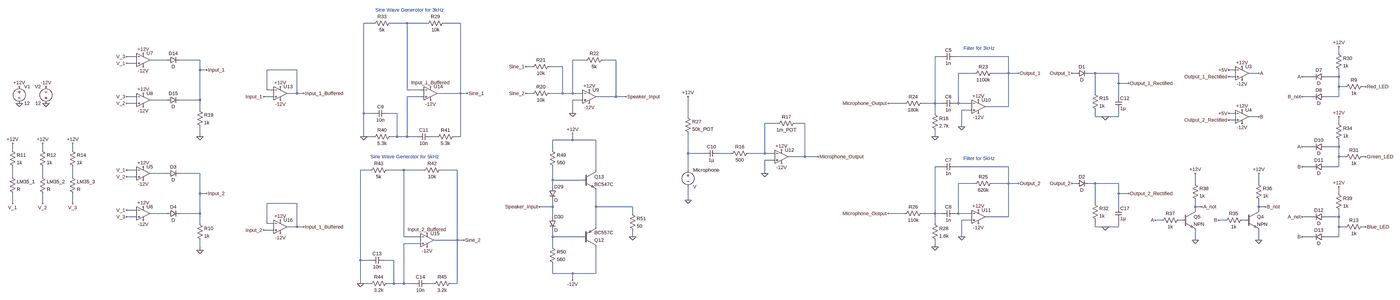
[diagram p0: schematic Project Schematic.asc, whole sheet]
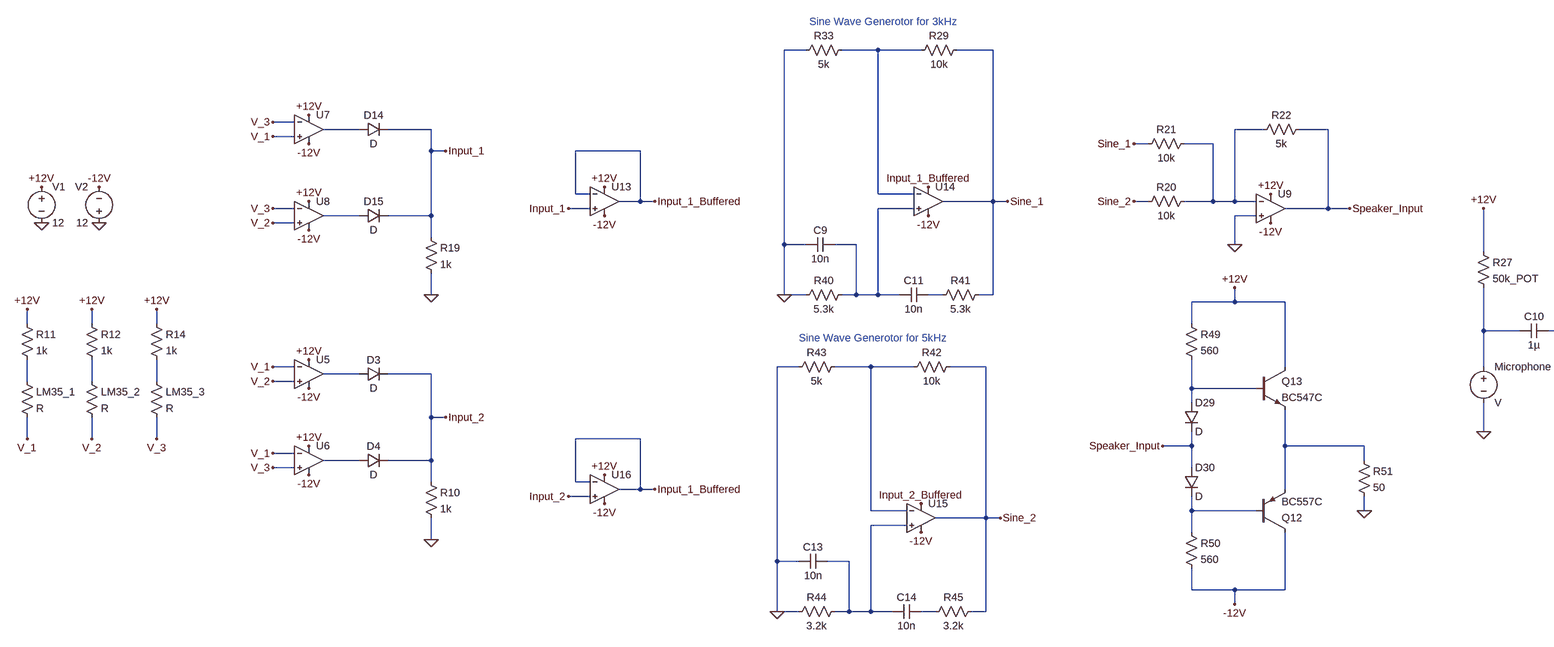
[diagram p1: schematic Project Schematic.asc, part, row 1 of 1, column 1 of 2]
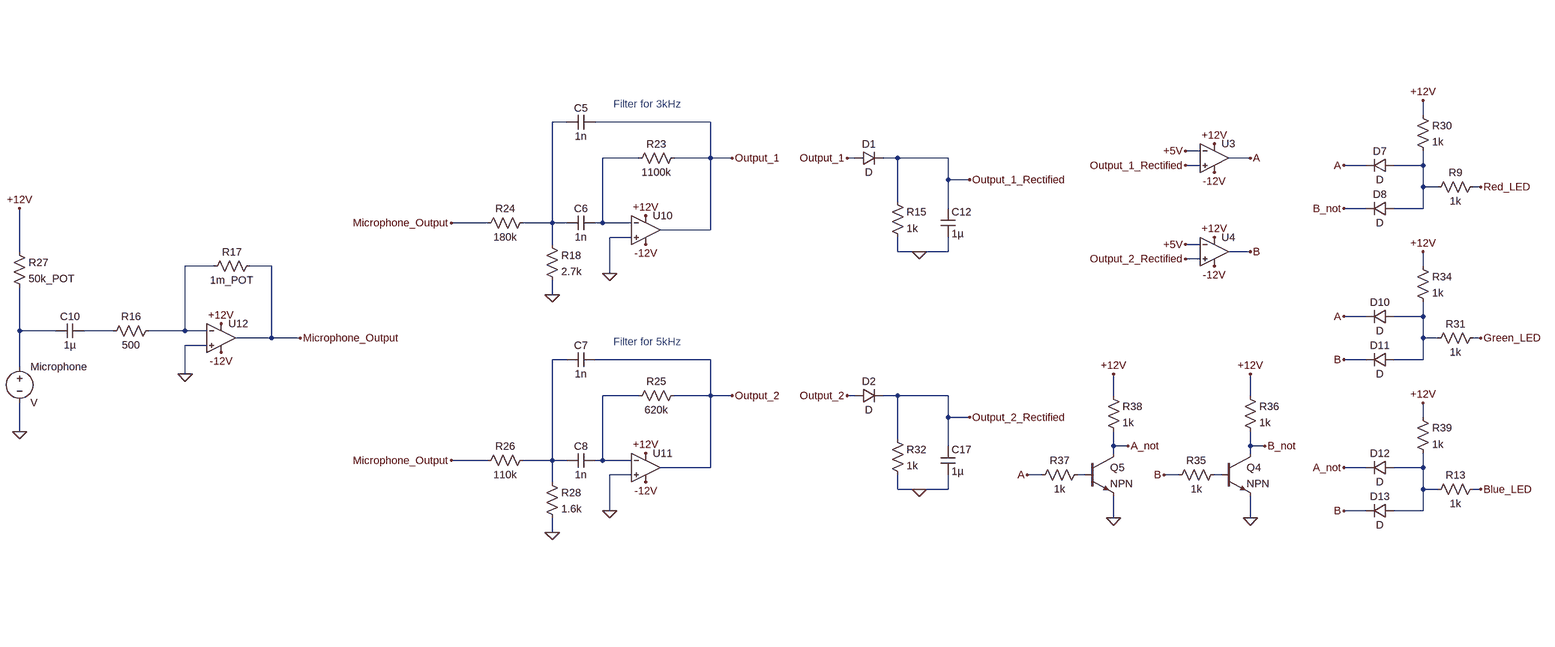
[diagram p2: schematic Project Schematic.asc, part, row 1 of 1, column 2 of 2]
Project Schematic.asc, the LTspice schematic file:
Version 4
SHEET 1 7060 2464
WIRE 1424 -832 1376 -832
WIRE 1584 -832 1504 -832
WIRE 1680 -832 1584 -832
WIRE 1840 -832 1760 -832
WIRE 6784 -688 6784 -720
WIRE 272 -672 224 -672
WIRE 4880 -672 4848 -672
WIRE 5200 -672 4944 -672
WIRE 416 -656 336 -656
WIRE 576 -656 480 -656
WIRE 2448 -656 2384 -656
WIRE 2592 -656 2528 -656
WIRE 272 -640 224 -640
WIRE 2192 -624 2160 -624
WIRE 2336 -624 2272 -624
WIRE 576 -608 576 -656
WIRE 608 -608 576 -608
WIRE 1056 -608 912 -608
WIRE 6288 -608 6256 -608
WIRE 5040 -592 4960 -592
WIRE 5200 -592 5200 -672
WIRE 5200 -592 5120 -592
WIRE 5248 -592 5200 -592
WIRE 5520 -592 5504 -592
WIRE 5616 -592 5584 -592
WIRE 5728 -592 5616 -592
WIRE 6400 -592 6352 -592
WIRE 6288 -576 6256 -576
WIRE 6656 -576 6608 -576
WIRE 6784 -576 6784 -608
WIRE 6784 -576 6720 -576
WIRE 5728 -544 5728 -592
WIRE 5776 -544 5728 -544
WIRE 6784 -528 6784 -576
WIRE 6816 -528 6784 -528
WIRE 6912 -528 6896 -528
WIRE 912 -512 912 -608
WIRE 944 -512 912 -512
WIRE 1584 -512 1584 -832
WIRE 1664 -512 1584 -512
WIRE 1056 -496 1056 -608
WIRE 1056 -496 1008 -496
WIRE 1088 -496 1056 -496
WIRE 1840 -496 1840 -832
WIRE 1840 -496 1728 -496
WIRE 1872 -496 1840 -496
WIRE 2192 -496 2160 -496
WIRE 2336 -496 2336 -624
WIRE 2336 -496 2272 -496
WIRE 2384 -496 2384 -656
WIRE 2384 -496 2336 -496
WIRE 2432 -496 2384 -496
WIRE 5616 -496 5616 -592
WIRE 272 -480 224 -480
WIRE 944 -480 896 -480
WIRE 1664 -480 1584 -480
WIRE 2592 -480 2592 -656
WIRE 2592 -480 2496 -480
WIRE 2640 -480 2592 -480
WIRE 5728 -480 5728 -544
WIRE 6656 -480 6608 -480
WIRE 6784 -480 6784 -528
WIRE 6784 -480 6720 -480
WIRE 416 -464 336 -464
WIRE 576 -464 576 -608
WIRE 576 -464 480 -464
WIRE 2432 -464 2384 -464
WIRE 272 -448 224 -448
WIRE 4704 -448 4624 -448
WIRE 4848 -448 4848 -672
WIRE 4848 -448 4784 -448
WIRE 4880 -448 4848 -448
WIRE 4960 -448 4960 -592
WIRE 4960 -448 4944 -448
WIRE 5024 -448 4960 -448
WIRE 5200 -432 5200 -592
WIRE 5200 -432 5088 -432
WIRE 576 -416 576 -464
WIRE 5024 -416 4976 -416
WIRE 1376 -400 1376 -832
WIRE 1424 -400 1376 -400
WIRE 1536 -400 1488 -400
WIRE 2384 -400 2384 -464
WIRE 4848 -400 4848 -448
WIRE 6288 -400 6256 -400
WIRE 3664 -384 3664 -480
WIRE 5616 -384 5616 -416
WIRE 5664 -384 5616 -384
WIRE 5728 -384 5728 -416
WIRE 5728 -384 5664 -384
WIRE 6400 -384 6352 -384
WIRE 6288 -368 6256 -368
WIRE 4096 -352 4032 -352
WIRE 4224 -352 4176 -352
WIRE 6784 -352 6784 -384
WIRE 4976 -336 4976 -416
WIRE 576 -288 576 -336
WIRE 1376 -288 1376 -400
WIRE 1424 -288 1376 -288
WIRE 1536 -288 1536 -400
WIRE 1536 -288 1504 -288
WIRE 1584 -288 1584 -480
WIRE 1584 -288 1536 -288
WIRE 1632 -288 1584 -288
WIRE 1728 -288 1696 -288
WIRE 1840 -288 1840 -496
WIRE 1840 -288 1808 -288
WIRE 4848 -288 4848 -320
WIRE 2384 -272 2384 -304
WIRE 2384 -272 2288 -272
WIRE 2496 -272 2384 -272
WIRE 6656 -240 6608 -240
WIRE 6784 -240 6784 -272
WIRE 6784 -240 6720 -240
WIRE -464 -224 -464 -256
WIRE -320 -224 -320 -256
WIRE -176 -224 -176 -256
WIRE 2288 -224 2288 -272
WIRE 3664 -208 3664 -304
WIRE 3744 -208 3664 -208
WIRE 3872 -208 3808 -208
WIRE 4032 -208 4032 -352
WIRE 4032 -208 3952 -208
WIRE 4080 -208 4032 -208
WIRE 4224 -192 4224 -352
WIRE 4224 -192 4144 -192
WIRE 4288 -192 4224 -192
WIRE 6784 -192 6784 -240
WIRE 6816 -192 6784 -192
WIRE 6912 -192 6896 -192
WIRE 4080 -176 4032 -176
WIRE 4880 -144 4848 -144
WIRE 5200 -144 4944 -144
WIRE 6656 -144 6608 -144
WIRE 6784 -144 6784 -192
WIRE 6784 -144 6720 -144
WIRE 272 -128 224 -128
WIRE 1408 -128 1360 -128
WIRE 1568 -128 1488 -128
WIRE 1664 -128 1568 -128
WIRE 1824 -128 1744 -128
WIRE 2496 -128 2496 -272
WIRE 3664 -128 3664 -208
WIRE 416 -112 336 -112
WIRE 576 -112 480 -112
WIRE 4032 -112 4032 -176
WIRE -464 -96 -464 -144
WIRE -320 -96 -320 -144
WIRE -176 -96 -176 -144
WIRE 272 -96 224 -96
WIRE 2288 -80 2288 -144
WIRE 2432 -80 2288 -80
WIRE 5040 -64 4960 -64
WIRE 5200 -64 5200 -144
WIRE 5200 -64 5120 -64
WIRE 5248 -64 5200 -64
WIRE 5520 -64 5504 -64
WIRE 5616 -64 5584 -64
WIRE 5728 -64 5616 -64
WIRE 6096 -64 6096 -112
WIRE 6400 -64 6400 -112
WIRE 2288 -48 2288 -80
WIRE 576 -16 576 -112
WIRE 608 -16 576 -16
WIRE 5728 -16 5728 -64
WIRE 5776 -16 5728 -16
WIRE 6784 -16 6784 -48
WIRE 3664 16 3664 -48
WIRE -464 32 -464 -16
WIRE -320 32 -320 -16
WIRE -176 32 -176 -16
WIRE 1056 32 912 32
WIRE 5616 32 5616 -64
WIRE 2288 48 2288 16
WIRE 2288 48 2224 48
WIRE 2496 48 2496 -32
WIRE 2672 48 2496 48
WIRE 5728 48 5728 -16
WIRE 6096 48 6096 16
WIRE 6128 48 6096 48
WIRE 6400 48 6400 16
WIRE 6432 48 6400 48
WIRE 272 64 224 64
WIRE 6096 64 6096 48
WIRE 6400 64 6400 48
WIRE 416 80 336 80
WIRE 576 80 576 -16
WIRE 576 80 480 80
WIRE 2672 80 2672 48
WIRE 4704 80 4624 80
WIRE 4848 80 4848 -144
WIRE 4848 80 4784 80
WIRE 4880 80 4848 80
WIRE 4960 80 4960 -64
WIRE 4960 80 4944 80
WIRE 5024 80 4960 80
WIRE 272 96 224 96
WIRE 2288 96 2288 48
WIRE 5200 96 5200 -64
WIRE 5200 96 5088 96
WIRE 6656 96 6608 96
WIRE 6784 96 6784 64
WIRE 6784 96 6720 96
WIRE 5024 112 4976 112
WIRE 5936 112 5904 112
WIRE 6032 112 6016 112
WIRE 6240 112 6208 112
WIRE 6336 112 6320 112
WIRE 576 128 576 80
WIRE 912 128 912 32
WIRE 944 128 912 128
WIRE 4848 128 4848 80
WIRE 1056 144 1056 32
WIRE 1056 144 1008 144
WIRE 1088 144 1056 144
WIRE 2496 144 2496 48
WIRE 5616 144 5616 112
WIRE 5664 144 5616 144
WIRE 5728 144 5728 112
WIRE 5728 144 5664 144
WIRE 6784 144 6784 96
WIRE 6816 144 6784 144
WIRE 6912 144 6896 144
WIRE 944 160 896 160
WIRE 1568 192 1568 -128
WIRE 1648 192 1568 192
WIRE 2288 192 2288 160
WIRE 2432 192 2288 192
WIRE 2672 192 2672 160
WIRE 4976 192 4976 112
WIRE 6656 192 6608 192
WIRE 6784 192 6784 144
WIRE 6784 192 6720 192
WIRE 1824 208 1824 -128
WIRE 1824 208 1712 208
WIRE 1856 208 1824 208
WIRE 6096 208 6096 160
WIRE 6400 208 6400 160
WIRE 1648 224 1568 224
WIRE 2288 240 2288 192
WIRE 4848 240 4848 208
WIRE 576 256 576 208
WIRE 1360 304 1360 -128
WIRE 1408 304 1360 304
WIRE 1520 304 1472 304
WIRE 2288 368 2288 320
WIRE 2384 368 2288 368
WIRE 2496 368 2496 240
WIRE 2496 368 2384 368
WIRE 2384 400 2384 368
WIRE 1360 416 1360 304
WIRE 1408 416 1360 416
WIRE 1520 416 1520 304
WIRE 1520 416 1488 416
WIRE 1568 416 1568 224
WIRE 1568 416 1520 416
WIRE 1616 416 1568 416
WIRE 1712 416 1680 416
WIRE 1824 416 1824 208
WIRE 1824 416 1792 416
FLAG -432 -448 0
FLAG -304 -448 0
FLAG -464 -256 +12V
FLAG -320 -256 +12V
FLAG -176 -256 +12V
FLAG -432 -528 +12V
FLAG -464 32 V_1
FLAG -320 32 V_2
FLAG -176 32 V_3
FLAG 224 -448 V_2
FLAG 224 -672 V_3
FLAG 224 -480 V_3
FLAG 224 -640 V_1
FLAG 304 -688 +12V
FLAG 304 -496 +12V
FLAG 304 -624 -12V
FLAG 304 -432 -12V
FLAG 576 -288 0
FLAG 608 -608 Input_1
FLAG -304 -528 -12V
FLAG 2464 -448 -12V
FLAG 2464 -512 +12V
FLAG 2384 -400 0
FLAG 2160 -624 Sine_1
FLAG 2160 -496 Sine_2
FLAG 2640 -480 Speaker_Input
FLAG 4976 -336 0
FLAG 5056 -464 +12V
FLAG 5056 -400 -12V
FLAG 4976 192 0
FLAG 5056 64 +12V
FLAG 5056 128 -12V
FLAG 4624 -448 Microphone_Output
FLAG 4624 80 Microphone_Output
FLAG 3664 -480 +12V
FLAG 4288 -192 Microphone_Output
FLAG 224 96 V_3
FLAG 224 -96 V_2
FLAG 224 -128 V_1
FLAG 224 64 V_1
FLAG 304 -144 +12V
FLAG 304 48 +12V
FLAG 304 -80 -12V
FLAG 304 112 -12V
FLAG 576 256 0
FLAG 608 -16 Input_2
FLAG 5248 -592 Output_1
FLAG 5248 -64 Output_2
FLAG 6912 -528 Red_LED
FLAG 3664 16 0
FLAG 6256 -576 Output_1_Rectified
FLAG 6256 -368 Output_2_Rectified
FLAG 5504 -64 Output_2
FLAG 5776 -16 Output_2_Rectified
FLAG 6320 -624 +12V
FLAG 6320 -352 -12V
FLAG 6320 -560 -12V
FLAG 6320 -416 +12V
FLAG 6256 -608 +5V
FLAG 6256 -400 +5V
FLAG 6400 -592 A
FLAG 6400 -384 B
FLAG 6784 -720 +12V
FLAG 6912 -192 Green_LED
FLAG 6784 -384 +12V
FLAG 6400 208 0
FLAG 6400 -112 +12V
FLAG 6096 208 0
FLAG 6096 -112 +12V
FLAG 5904 112 A
FLAG 6128 48 A_not
FLAG 6432 48 B_not
FLAG 6208 112 B
FLAG 6912 144 Blue_LED
FLAG 6784 -48 +12V
FLAG 6608 -576 A
FLAG 6608 -144 B
FLAG 6608 192 B
FLAG 6608 -240 A
FLAG 6608 96 A_not
FLAG 6608 -480 B_not
FLAG 2672 192 0
FLAG 2384 -304 +12V
FLAG 2384 400 -12V
FLAG 2224 48 Speaker_Input
FLAG 5664 144 0
FLAG 5504 -592 Output_1
FLAG 5776 -544 Output_1_Rectified
FLAG 5664 -384 0
FLAG 4032 -112 0
FLAG 4112 -224 +12V
FLAG 4112 -160 -12V
FLAG 4848 -288 0
FLAG 4848 240 0
FLAG 976 -528 +12V
FLAG 976 -464 -12V
FLAG 1696 -528 Input_1_Buffered
FLAG 1696 -464 -12V
FLAG 1680 176 Input_2_Buffered
FLAG 1680 240 -12V
FLAG 1872 -496 Sine_1
FLAG 1856 208 Sine_2
FLAG 1360 416 0
FLAG 1376 -288 0
FLAG 896 -480 Input_1
FLAG 1088 -496 Input_1_Buffered
FLAG 976 112 +12V
FLAG 976 176 -12V
FLAG 896 160 Input_2
FLAG 1088 144 Input_1_Buffered
SYMBOL voltage -432 -544 R0
WINDOW 123 0 0 Left 2
WINDOW 39 0 0 Left 2
SYMATTR InstName V1
SYMATTR Value 12
SYMBOL voltage -304 -432 R180
WINDOW 0 24 96 Left 2
WINDOW 3 24 16 Left 2
WINDOW 123 0 0 Left 2
WINDOW 39 0 0 Left 2
SYMATTR InstName V2
SYMATTR Value 12
SYMBOL res -480 -112 R0
SYMATTR InstName LM35_1
SYMBOL res -336 -112 R0
SYMATTR InstName LM35_2
SYMBOL res -480 -240 R0
SYMATTR InstName R11
SYMATTR Value 1k
SYMBOL res -336 -240 R0
SYMATTR InstName R12
SYMATTR Value 1k
SYMBOL res -192 -112 R0
SYMATTR InstName LM35_3
SYMBOL res -192 -240 R0
SYMATTR InstName R14
SYMATTR Value 1k
SYMBOL Opamps\\UniversalOpamp2 304 -656 R0
SYMATTR InstName U7
SYMBOL Opamps\\UniversalOpamp2 304 -464 R0
SYMATTR InstName U8
SYMBOL res 560 -432 R0
SYMATTR InstName R19
SYMATTR Value 1k
SYMBOL diode 416 -640 R270
WINDOW 0 32 32 VTop 2
WINDOW 3 0 32 VBottom 2
SYMATTR InstName D14
SYMBOL diode 416 -448 R270
WINDOW 0 32 32 VTop 2
WINDOW 3 0 32 VBottom 2
SYMATTR InstName D15
SYMBOL Opamps\\UniversalOpamp2 2464 -480 R0
SYMATTR InstName U9
SYMBOL res 2288 -512 R90
WINDOW 0 0 56 VBottom 2
WINDOW 3 32 56 VTop 2
SYMATTR InstName R20
SYMATTR Value 10k
SYMBOL res 2288 -640 R90
WINDOW 0 0 56 VBottom 2
WINDOW 3 32 56 VTop 2
SYMATTR InstName R21
SYMATTR Value 10k
SYMBOL res 2544 -672 R90
WINDOW 0 0 56 VBottom 2
WINDOW 3 32 56 VTop 2
SYMATTR InstName R22
SYMATTR Value 5k
SYMBOL Opamps\\UniversalOpamp2 5056 -432 R0
SYMATTR InstName U10
SYMBOL res 5136 -608 R90
WINDOW 0 0 56 VBottom 2
WINDOW 3 32 56 VTop 2
SYMATTR InstName R23
SYMATTR Value 1100k
SYMBOL cap 4944 -688 R90
WINDOW 0 0 32 VBottom 2
WINDOW 3 32 32 VTop 2
SYMATTR InstName C5
SYMATTR Value 1n
SYMBOL cap 4944 -464 R90
WINDOW 0 0 32 VBottom 2
WINDOW 3 32 32 VTop 2
SYMATTR InstName C6
SYMATTR Value 1n
SYMBOL res 4800 -464 R90
WINDOW 0 0 56 VBottom 2
WINDOW 3 32 56 VTop 2
SYMATTR InstName R24
SYMATTR Value 180k
SYMBOL Opamps\\UniversalOpamp2 5056 96 R0
SYMATTR InstName U11
SYMBOL res 5136 -80 R90
WINDOW 0 0 56 VBottom 2
WINDOW 3 32 56 VTop 2
SYMATTR InstName R25
SYMATTR Value 620k
SYMBOL cap 4944 -160 R90
WINDOW 0 0 32 VBottom 2
WINDOW 3 32 32 VTop 2
SYMATTR InstName C7
SYMATTR Value 1n
SYMBOL cap 4944 64 R90
WINDOW 0 0 32 VBottom 2
WINDOW 3 32 32 VTop 2
SYMATTR InstName C8
SYMATTR Value 1n
SYMBOL res 4800 64 R90
WINDOW 0 0 56 VBottom 2
WINDOW 3 32 56 VTop 2
SYMATTR InstName R26
SYMATTR Value 110k
SYMBOL res 3648 -400 R0
SYMATTR InstName R27
SYMATTR Value 50k_POT
SYMBOL cap 3808 -224 R90
WINDOW 0 0 32 VBottom 2
WINDOW 3 32 32 VTop 2
SYMATTR InstName C10
SYMATTR Value 1µ
SYMBOL voltage 3664 -144 R0
SYMATTR InstName Microphone
SYMBOL Opamps\\UniversalOpamp2 304 -112 R0
SYMATTR InstName U5
SYMBOL Opamps\\UniversalOpamp2 304 80 R0
SYMATTR InstName U6
SYMBOL res 560 112 R0
SYMATTR InstName R10
SYMATTR Value 1k
SYMBOL diode 416 -96 R270
WINDOW 0 32 32 VTop 2
WINDOW 3 0 32 VBottom 2
SYMATTR InstName D3
SYMBOL diode 416 96 R270
WINDOW 0 32 32 VTop 2
WINDOW 3 0 32 VBottom 2
SYMATTR InstName D4
SYMBOL res 6912 -544 R90
WINDOW 0 0 56 VBottom 2
WINDOW 3 32 56 VTop 2
SYMATTR InstName R9
SYMATTR Value 1k
SYMBOL res 5600 16 R0
SYMATTR InstName R32
SYMATTR Value 1k
SYMBOL cap 5712 48 R0
SYMATTR InstName C17
SYMATTR Value 1µ
SYMBOL Opamps\\UniversalOpamp2 6320 -592 R0
SYMATTR InstName U3
SYMBOL Opamps\\UniversalOpamp2 6320 -384 R0
SYMATTR InstName U4
SYMBOL diode 6720 -592 R90
WINDOW 0 0 32 VBottom 2
WINDOW 3 32 32 VTop 2
SYMATTR InstName D7
SYMBOL diode 6720 -496 R90
WINDOW 0 0 32 VBottom 2
WINDOW 3 32 32 VTop 2
SYMATTR InstName D8
SYMBOL res 6768 -704 R0
SYMATTR InstName R30
SYMATTR Value 1k
SYMBOL res 6912 -208 R90
WINDOW 0 0 56 VBottom 2
WINDOW 3 32 56 VTop 2
SYMATTR InstName R31
SYMATTR Value 1k
SYMBOL diode 6720 -256 R90
WINDOW 0 0 32 VBottom 2
WINDOW 3 32 32 VTop 2
SYMATTR InstName D10
SYMBOL diode 6720 -160 R90
WINDOW 0 0 32 VBottom 2
WINDOW 3 32 32 VTop 2
SYMATTR InstName D11
SYMBOL res 6768 -368 R0
SYMATTR InstName R34
SYMATTR Value 1k
SYMBOL npn 6336 64 R0
SYMATTR InstName Q4
SYMBOL res 6336 96 R90
WINDOW 0 0 56 VBottom 2
WINDOW 3 32 56 VTop 2
SYMATTR InstName R35
SYMATTR Value 1k
SYMBOL res 6384 -80 R0
SYMATTR InstName R36
SYMATTR Value 1k
SYMBOL npn 6032 64 R0
SYMATTR InstName Q5
SYMBOL res 6032 96 R90
WINDOW 0 0 56 VBottom 2
WINDOW 3 32 56 VTop 2
SYMATTR InstName R37
SYMATTR Value 1k
SYMBOL res 6080 -80 R0
SYMATTR InstName R38
SYMATTR Value 1k
SYMBOL res 6912 128 R90
WINDOW 0 0 56 VBottom 2
WINDOW 3 32 56 VTop 2
SYMATTR InstName R13
SYMATTR Value 1k
SYMBOL diode 6720 80 R90
WINDOW 0 0 32 VBottom 2
WINDOW 3 32 32 VTop 2
SYMATTR InstName D12
SYMBOL diode 6720 176 R90
WINDOW 0 0 32 VBottom 2
WINDOW 3 32 32 VTop 2
SYMATTR InstName D13
SYMBOL res 6768 -32 R0
SYMATTR InstName R39
SYMATTR Value 1k
SYMBOL res 2272 -240 R0
SYMATTR InstName R49
SYMATTR Value 560
SYMBOL diode 2272 -48 R0
SYMATTR InstName D29
SYMBOL diode 2272 96 R0
SYMATTR InstName D30
SYMBOL res 2272 224 R0
SYMATTR InstName R50
SYMATTR Value 560
SYMBOL pnp 2432 240 M180
SYMATTR InstName Q12
SYMATTR Value BC557C
SYMBOL npn 2432 -128 R0
SYMATTR InstName Q13
SYMATTR Value BC547C
SYMBOL res 2656 64 R0
SYMATTR InstName R51
SYMATTR Value 50
SYMBOL diode 5520 -48 R270
WINDOW 0 32 32 VTop 2
WINDOW 3 0 32 VBottom 2
SYMATTR InstName D2
SYMBOL res 5600 -512 R0
SYMATTR InstName R15
SYMATTR Value 1k
SYMBOL cap 5712 -480 R0
SYMATTR InstName C12
SYMATTR Value 1µ
SYMBOL diode 5520 -576 R270
WINDOW 0 32 32 VTop 2
WINDOW 3 0 32 VBottom 2
SYMATTR InstName D1
SYMBOL res 3968 -224 R90
WINDOW 0 0 56 VBottom 2
WINDOW 3 32 56 VTop 2
SYMATTR InstName R16
SYMATTR Value 500
SYMBOL Opamps\\UniversalOpamp2 4112 -192 R0
SYMATTR InstName U12
SYMBOL res 4192 -368 R90
WINDOW 0 0 56 VBottom 2
WINDOW 3 32 56 VTop 2
SYMATTR InstName R17
SYMATTR Value 1m_POT
SYMBOL res 4832 -416 R0
SYMATTR InstName R18
SYMATTR Value 2.7k
SYMBOL res 4832 112 R0
SYMATTR InstName R28
SYMATTR Value 1.6k
SYMBOL Opamps\\UniversalOpamp2 976 -496 R0
SYMATTR InstName U13
SYMBOL Opamps\\UniversalOpamp2 1696 -496 R0
SYMATTR InstName U14
SYMBOL res 1776 -848 R90
WINDOW 0 0 56 VBottom 2
WINDOW 3 32 56 VTop 2
SYMATTR InstName R29
SYMATTR Value 10k
SYMBOL res 1520 -848 R90
WINDOW 0 0 56 VBottom 2
WINDOW 3 32 56 VTop 2
SYMATTR InstName R33
SYMATTR Value 5k
SYMBOL cap 1488 -416 R90
WINDOW 0 0 32 VBottom 2
WINDOW 3 32 32 VTop 2
SYMATTR InstName C9
SYMATTR Value 10n
SYMBOL res 1520 -304 R90
WINDOW 0 0 56 VBottom 2
WINDOW 3 32 56 VTop 2
SYMATTR InstName R40
SYMATTR Value 5.3k
SYMBOL res 1824 -304 R90
WINDOW 0 0 56 VBottom 2
WINDOW 3 32 56 VTop 2
SYMATTR InstName R41
SYMATTR Value 5.3k
SYMBOL cap 1696 -304 R90
WINDOW 0 0 32 VBottom 2
WINDOW 3 32 32 VTop 2
SYMATTR InstName C11
SYMATTR Value 10n
SYMBOL Opamps\\UniversalOpamp2 1680 208 R0
SYMATTR InstName U15
SYMBOL res 1760 -144 R90
WINDOW 0 0 56 VBottom 2
WINDOW 3 32 56 VTop 2
SYMATTR InstName R42
SYMATTR Value 10k
SYMBOL res 1504 -144 R90
WINDOW 0 0 56 VBottom 2
WINDOW 3 32 56 VTop 2
SYMATTR InstName R43
SYMATTR Value 5k
SYMBOL cap 1472 288 R90
WINDOW 0 0 32 VBottom 2
WINDOW 3 32 32 VTop 2
SYMATTR InstName C13
SYMATTR Value 10n
SYMBOL res 1504 400 R90
WINDOW 0 0 56 VBottom 2
WINDOW 3 32 56 VTop 2
SYMATTR InstName R44
SYMATTR Value 3.2k
SYMBOL res 1808 400 R90
WINDOW 0 0 56 VBottom 2
WINDOW 3 32 56 VTop 2
SYMATTR InstName R45
SYMATTR Value 3.2k
SYMBOL cap 1680 400 R90
WINDOW 0 0 32 VBottom 2
WINDOW 3 32 32 VTop 2
SYMATTR InstName C14
SYMATTR Value 10n
SYMBOL Opamps\\UniversalOpamp2 976 144 R0
SYMATTR InstName U16
TEXT 4984 -712 Left 2 ;Filter for 3kHz
TEXT 4984 -184 Left 2 ;Filter for 5kHz
TEXT 1432 -896 Left 2 ;Sine Wave Generotor for 3kHz
TEXT 1408 -192 Left 2 ;Sine Wave Generotor for 5kHz

The netlist it stands for:
* Project Schematic.asc
V1 +12V 0 12
V2 0 -12V 12
R§LM35_1 N017 V_1 R
R§LM35_2 N018 V_2 R
R11 +12V N017 1k
R12 +12V N018 1k
R§LM35_3 N019 V_3 R
R14 +12V N019 1k
XU7 V_1 V_3 +12V -12V N003 level.2 Avol=1Meg GBW=10Meg Slew=10Meg ilimit=25m rail=0 Vos=0 phimargin=45 en=0 enk=0 in=0 ink=0 Rin=500Meg  ; pins IN+ IN- V+ V- OUT
XU8 V_2 V_3 +12V -12V N008 level.2 Avol=1Meg GBW=10Meg Slew=10Meg ilimit=25m rail=0 Vos=0 phimargin=45 en=0 enk=0 in=0 ink=0 Rin=500Meg  ; pins IN+ IN- V+ V- OUT
R19 Input_1 0 1k
D14 N003 Input_1 D
D15 N008 Input_1 D
XU9 0 N004 +12V -12V Speaker_Input level.2 Avol=1Meg GBW=10Meg Slew=10Meg ilimit=25m rail=0 Vos=0 phimargin=45 en=0 enk=0 in=0 ink=0 Rin=500Meg  ; pins IN+ IN- V+ V- OUT
R20 N004 Sine_2 10k
R21 N004 Sine_1 10k
R22 Speaker_Input N004 5k
XU10 0 N005 +12V -12V Output_1 level.2 Avol=1Meg GBW=10Meg Slew=10Meg ilimit=25m rail=0 Vos=0 phimargin=45 en=0 enk=0 in=0 ink=0 Rin=500Meg  ; pins IN+ IN- V+ V- OUT
R23 Output_1 N005 1100k
C5 Output_1 N002 1n
C6 N005 N002 1n
R24 N002 Microphone_Output 180k
XU11 0 N021 +12V -12V Output_2 level.2 Avol=1Meg GBW=10Meg Slew=10Meg ilimit=25m rail=0 Vos=0 phimargin=45 en=0 enk=0 in=0 ink=0 Rin=500Meg  ; pins IN+ IN- V+ V- OUT
R25 Output_2 N021 620k
C7 Output_2 N014 1n
C8 N021 N014 1n
R26 N014 Microphone_Output 110k
R27 +12V N012 50k_POT
C10 N013 N012 1µ
V§Microphone N012 0 V
XU5 V_2 V_1 +12V -12V N016 level.2 Avol=1Meg GBW=10Meg Slew=10Meg ilimit=25m rail=0 Vos=0 phimargin=45 en=0 enk=0 in=0 ink=0 Rin=500Meg  ; pins IN+ IN- V+ V- OUT
XU6 V_3 V_1 +12V -12V N023 level.2 Avol=1Meg GBW=10Meg Slew=10Meg ilimit=25m rail=0 Vos=0 phimargin=45 en=0 enk=0 in=0 ink=0 Rin=500Meg  ; pins IN+ IN- V+ V- OUT
R10 Input_2 0 1k
D3 N016 Input_2 D
D4 N023 Input_2 D
R9 Red_LED N006 1k
R32 Output_2_Rectified 0 1k
C17 Output_2_Rectified 0 1µ
XU3 Output_1_Rectified +5V +12V -12V A level.2 Avol=1Meg GBW=10Meg Slew=10Meg ilimit=25m rail=0 Vos=0 phimargin=45 en=0 enk=0 in=0 ink=0 Rin=500Meg  ; pins IN+ IN- V+ V- OUT
XU4 Output_2_Rectified +5V +12V -12V B level.2 Avol=1Meg GBW=10Meg Slew=10Meg ilimit=25m rail=0 Vos=0 phimargin=45 en=0 enk=0 in=0 ink=0 Rin=500Meg  ; pins IN+ IN- V+ V- OUT
D7 N006 A D
D8 N006 B_not D
R30 +12V N006 1k
R31 Green_LED N011 1k
D10 N011 A D
D11 N011 B D
R34 +12V N011 1k
Q4 B_not N026 0 0 NPN
R35 N026 B 1k
R36 +12V B_not 1k
Q5 A_not N025 0 0 NPN
R37 N025 A 1k
R38 +12V A_not 1k
R13 Blue_LED N024 1k
D12 N024 A_not D
D13 N024 B D
R39 +12V N024 1k
R49 +12V N020 560
D29 N020 Speaker_Input D
D30 Speaker_Input N027 D
R50 N027 -12V 560
Q12 -12V N027 N022 0 BC557C
Q13 +12V N020 N022 0 BC547C
R51 N022 0 50
D2 Output_2 Output_2_Rectified D
R15 Output_1_Rectified 0 1k
C12 Output_1_Rectified 0 1µ
D1 Output_1 Output_1_Rectified D
R16 N009 N013 500
XU12 0 N009 +12V -12V Microphone_Output level.2 Avol=1Meg GBW=10Meg Slew=10Meg ilimit=25m rail=0 Vos=0 phimargin=45 en=0 enk=0 in=0 ink=0 Rin=500Meg  ; pins IN+ IN- V+ V- OUT
R17 Microphone_Output N009 1m_POT
R18 N002 0 2.7k
R28 N014 0 1.6k
XU13 Input_1 Input_1_Buffered +12V -12V Input_1_Buffered level.2 Avol=1Meg GBW=10Meg Slew=10Meg ilimit=25m rail=0 Vos=0 phimargin=45 en=0 enk=0 in=0 ink=0 Rin=500Meg  ; pins IN+ IN- V+ V- OUT
XU14 N007 N001 Input_1_Buffered -12V Sine_1 level.2 Avol=1Meg GBW=10Meg Slew=10Meg ilimit=25m rail=0 Vos=0 phimargin=45 en=0 enk=0 in=0 ink=0 Rin=500Meg  ; pins IN+ IN- V+ V- OUT
R29 Sine_1 N001 10k
R33 N001 0 5k
C9 N007 0 10n
R40 N007 0 5.3k
R41 Sine_1 N010 5.3k
C11 N010 N007 10n
XU15 N028 N015 Input_2_Buffered -12V Sine_2 level.2 Avol=1Meg GBW=10Meg Slew=10Meg ilimit=25m rail=0 Vos=0 phimargin=45 en=0 enk=0 in=0 ink=0 Rin=500Meg  ; pins IN+ IN- V+ V- OUT
R42 Sine_2 N015 10k
R43 N015 0 5k
C13 N028 0 10n
R44 N028 0 3.2k
R45 Sine_2 N029 3.2k
C14 N029 N028 10n
XU16 Input_2 Input_1_Buffered +12V -12V Input_1_Buffered level.2 Avol=1Meg GBW=10Meg Slew=10Meg ilimit=25m rail=0 Vos=0 phimargin=45 en=0 enk=0 in=0 ink=0 Rin=500Meg  ; pins IN+ IN- V+ V- OUT
.model D D
.lib standard.dio
.model NPN NPN
.model PNP PNP
.lib standard.bjt
* Filter for 3kHz
* Filter for 5kHz
* Sine Wave Generotor for 3kHz
* Sine Wave Generotor for 5kHz
.lib UniversalOpamps2.sub
.backanno
.end